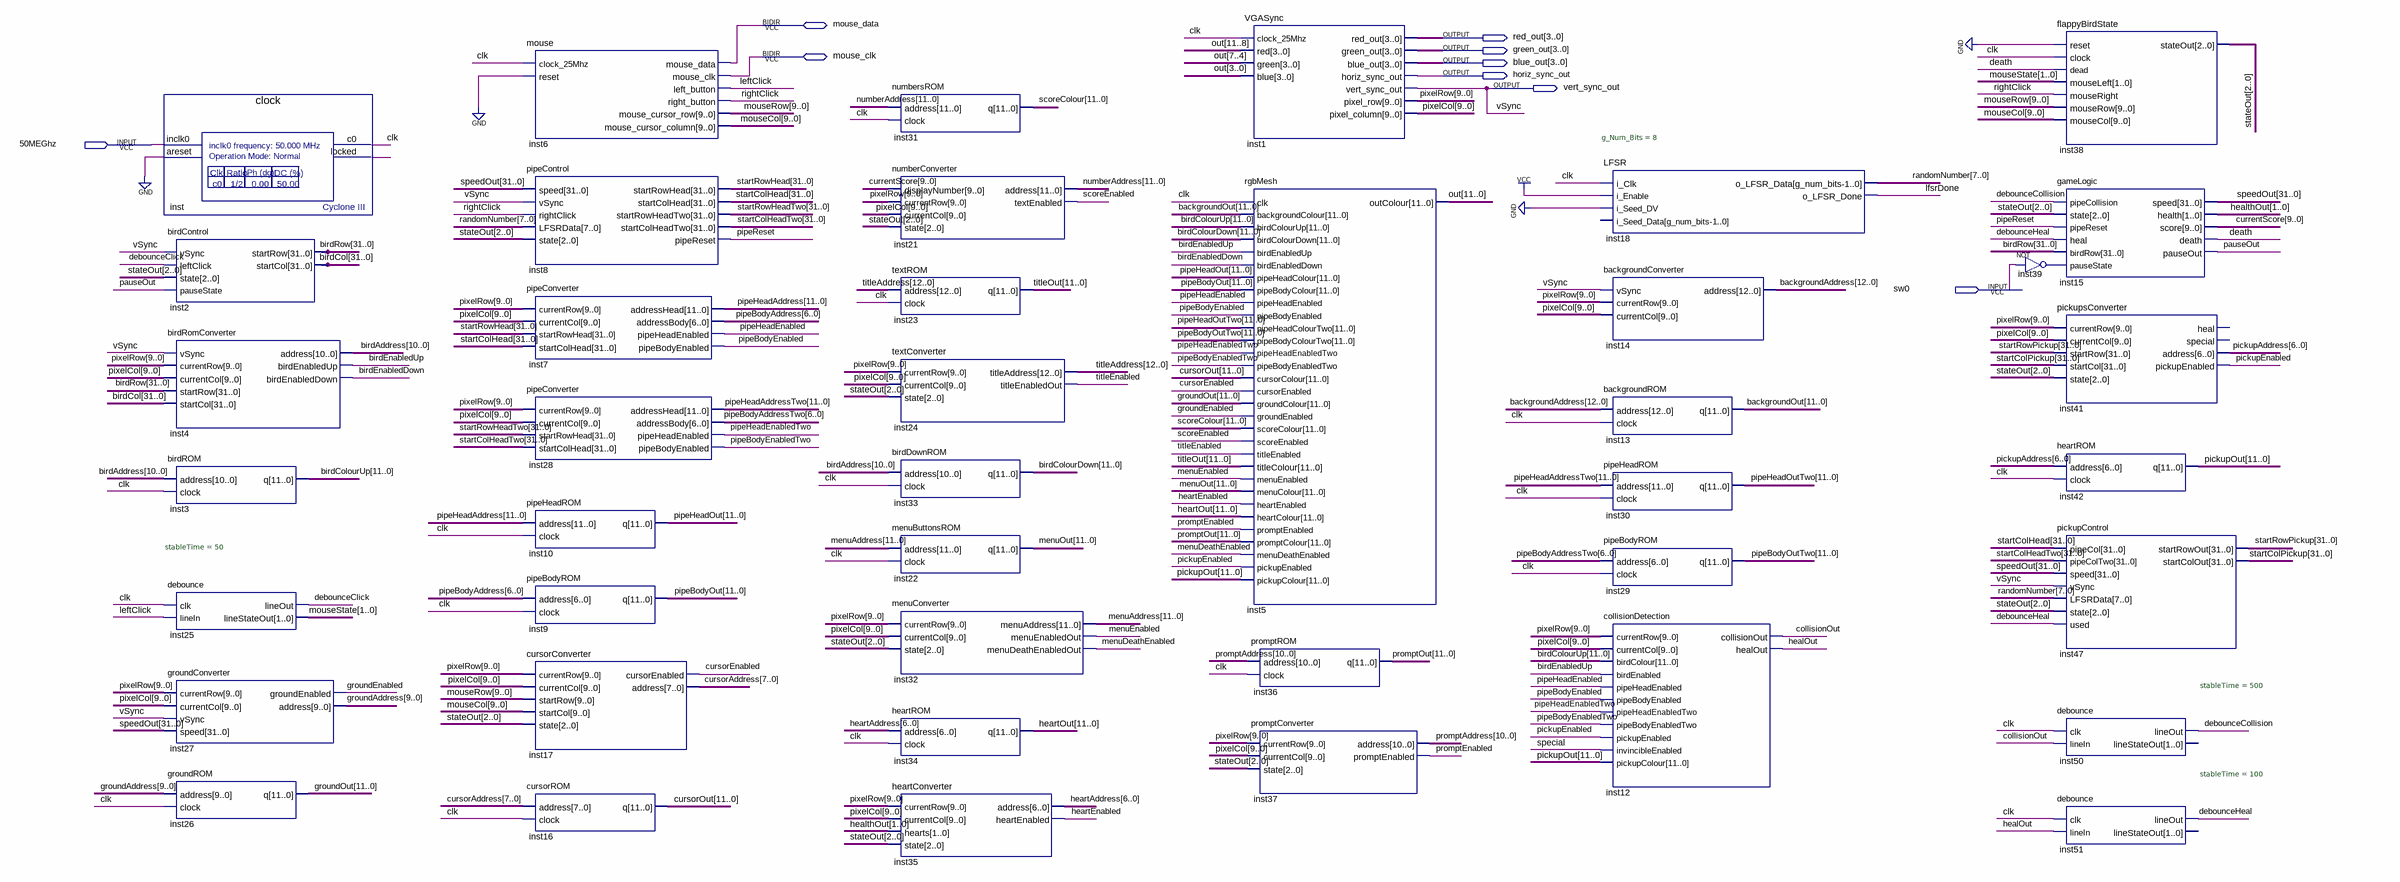
[diagram p0: schematic sheet]
// Quartus schematic FlappyBird.bdf as structural Verilog: 42 symbols, 9 pins
module FlappyBird (
  input  \50MEGhz ,
  input  sw0,
  inout  mouse_data,
  inout  mouse_clk,
  output [3:0] red_out,
  output [3:0] green_out,
  output [3:0] blue_out,
  output horiz_sync_out,
  output vert_sync_out
);

  wire birdEnabledDown, birdEnabledUp, clk, collisionOut, cursorEnabled, death, debounceClick,
       debounceCollision, debounceHeal, groundEnabled, healOut, heartEnabled, inst39_out, inst_locked,
       leftClick, lfsrDone, menuDeathEnabled, menuEnabled, pauseOut, pickupEnabled, pipeBodyEnabled,
       pipeBodyEnabledTwo, pipeHeadEnabled, pipeHeadEnabledTwo, pipeReset, promptEnabled, rightClick,
       scoreEnabled, special, titleEnabled;
  wire [1:0] healthOut, mouseState;
  wire [2:0] stateOut;
  wire [6:0] heartAddress, pickupAddress, pipeBodyAddress, pipeBodyAddressTwo;
  wire [7:0] cursorAddress, randomNumber;
  wire [9:0] currentScore, groundAddress, mouseCol, mouseRow, pixelCol, pixelRow;
  wire [10:0] birdAddress, promptAddress;
  wire [11:0] backgroundOut, birdColourDown, birdColourUp, cursorOut, groundOut, heartOut, menuAddress,
       menuOut, numberAddress, out, pickupOut, pipeBodyOut, pipeBodyOutTwo, pipeHeadAddress,
       pipeHeadAddressTwo, pipeHeadOut, pipeHeadOutTwo, promptOut, scoreColour, titleOut;
  wire [12:0] backgroundAddress, titleAddress;
  wire [31:0] birdCol, birdRow, speedOut, startColHead, startColHeadTwo, startColPickup, startRowHead,
       startRowHeadTwo, startRowPickup;

  clock inst (.inclk0(\50MEGhz ), .areset(1'b0), .c0(clk), .locked(inst_locked));
  birdControl inst2 (
    .vSync(vert_sync_out), .leftClick(debounceClick), .state(stateOut), .pauseState(pauseOut),
    .startRow(birdRow), .startCol(birdCol));
  birdRomConverter inst4 (
    .vSync(vert_sync_out), .currentRow(pixelRow), .currentCol(pixelCol), .startRow(birdRow),
    .startCol(birdCol), .address(birdAddress), .birdEnabledUp(birdEnabledUp),
    .birdEnabledDown(birdEnabledDown));
  birdROM inst3 (.address(birdAddress), .clock(clk), .q(birdColourUp));
  debounce #(.stableTime(50)) inst25 (
    .clk(clk), .lineIn(leftClick), .lineOut(debounceClick), .lineStateOut(mouseState));
  groundConverter inst27 (
    .currentRow(pixelRow), .currentCol(pixelCol), .vSync(vert_sync_out), .speed(speedOut),
    .groundEnabled(groundEnabled), .address(groundAddress));
  groundROM inst26 (.address(groundAddress), .clock(clk), .q(groundOut));
  mouse inst6 (
    .clock_25Mhz(clk), .reset(1'b0), .left_button(leftClick), .right_button(rightClick),
    .mouse_cursor_row(mouseRow), .mouse_cursor_column(mouseCol), .mouse_data(mouse_data),
    .mouse_clk(mouse_clk));
  pipeControl inst8 (
    .speed(speedOut), .vSync(vert_sync_out), .rightClick(rightClick), .LFSRData(randomNumber),
    .state(stateOut), .startRowHead(startRowHead), .startColHead(startColHead),
    .startRowHeadTwo(startRowHeadTwo), .startColHeadTwo(startColHeadTwo), .pipeReset(pipeReset));
  pipeConverter inst7 (
    .currentRow(pixelRow), .currentCol(pixelCol), .startRowHead(startRowHead), .startColHead(startColHead),
    .addressHead(pipeHeadAddress), .addressBody(pipeBodyAddress), .pipeHeadEnabled(pipeHeadEnabled),
    .pipeBodyEnabled(pipeBodyEnabled));
  pipeConverter inst28 (
    .currentRow(pixelRow), .currentCol(pixelCol), .startRowHead(startRowHeadTwo),
    .startColHead(startColHeadTwo), .addressHead(pipeHeadAddressTwo), .addressBody(pipeBodyAddressTwo),
    .pipeHeadEnabled(pipeHeadEnabledTwo), .pipeBodyEnabled(pipeBodyEnabledTwo));
  pipeHeadROM inst10 (.address(pipeHeadAddress), .clock(clk), .q(pipeHeadOut));
  pipeBodyROM inst9 (.address(pipeBodyAddress), .clock(clk), .q(pipeBodyOut));
  cursorConverter inst17 (
    .currentRow(pixelRow), .currentCol(pixelCol), .startRow(mouseRow), .startCol(mouseCol), .state(stateOut),
    .cursorEnabled(cursorEnabled), .address(cursorAddress));
  cursorROM inst16 (.address(cursorAddress), .clock(clk), .q(cursorOut));
  numbersROM inst31 (.address(numberAddress), .clock(clk), .q(scoreColour));
  numberConverter inst21 (
    .displayNumber(currentScore), .currentRow(pixelRow), .currentCol(pixelCol), .state(stateOut),
    .address(numberAddress), .textEnabled(scoreEnabled));
  textROM inst23 (.address(titleAddress), .clock(clk), .q(titleOut));
  textConverter inst24 (
    .currentRow(pixelRow), .currentCol(pixelCol), .state(stateOut), .titleAddress(titleAddress),
    .titleEnabledOut(titleEnabled));
  birdDownROM inst33 (.address(birdAddress), .clock(clk), .q(birdColourDown));
  menuButtonsROM inst22 (.address(menuAddress), .clock(clk), .q(menuOut));
  menuConverter inst32 (
    .currentRow(pixelRow), .currentCol(pixelCol), .state(stateOut), .menuAddress(menuAddress),
    .menuEnabledOut(menuEnabled), .menuDeathEnabledOut(menuDeathEnabled));
  heartROM inst34 (.address(heartAddress), .clock(clk), .q(heartOut));
  heartConverter inst35 (
    .currentRow(pixelRow), .currentCol(pixelCol), .hearts(healthOut), .state(stateOut),
    .address(heartAddress), .heartEnabled(heartEnabled));
  VGASync inst1 (
    .clock_25Mhz(clk), .red(out[11:8]), .green(out[7:4]), .blue(out[3:0]), .red_out(red_out),
    .green_out(green_out), .blue_out(blue_out), .horiz_sync_out(horiz_sync_out),
    .vert_sync_out(vert_sync_out), .pixel_row(pixelRow), .pixel_column(pixelCol));
  rgbMesh inst5 (
    .clk(clk), .backgroundColour(backgroundOut), .birdColourUp(birdColourUp),
    .birdColourDown(birdColourDown), .birdEnabledUp(birdEnabledUp), .birdEnabledDown(birdEnabledDown),
    .pipeHeadColour(pipeHeadOut), .pipeBodyColour(pipeBodyOut), .pipeHeadEnabled(pipeHeadEnabled),
    .pipeBodyEnabled(pipeBodyEnabled), .pipeHeadColourTwo(pipeHeadOutTwo),
    .pipeBodyColourTwo(pipeBodyOutTwo), .pipeHeadEnabledTwo(pipeHeadEnabledTwo),
    .pipeBodyEnabledTwo(pipeBodyEnabledTwo), .cursorColour(cursorOut), .cursorEnabled(cursorEnabled),
    .groundColour(groundOut), .groundEnabled(groundEnabled), .scoreColour(scoreColour),
    .scoreEnabled(scoreEnabled), .titleEnabled(titleEnabled), .titleColour(titleOut),
    .menuEnabled(menuEnabled), .menuColour(menuOut), .heartEnabled(heartEnabled), .heartColour(heartOut),
    .promptEnabled(promptEnabled), .promptColour(promptOut), .menuDeathEnabled(menuDeathEnabled),
    .pickupEnabled(pickupEnabled), .pickupColour(pickupOut), .outColour(out));
  promptROM inst36 (.address(promptAddress), .clock(clk), .q(promptOut));
  promptConverter inst37 (
    .currentRow(pixelRow), .currentCol(pixelCol), .state(stateOut), .address(promptAddress),
    .promptEnabled(promptEnabled));
  LFSR #(.g_Num_Bits(8)) inst18 (
    .i_Clk(clk), .i_Enable(1'b1), .i_Seed_DV(1'b0), .o_LFSR_Data(randomNumber), .o_LFSR_Done(lfsrDone));  // open: i_Seed_Data
  backgroundConverter inst14 (
    .vSync(vert_sync_out), .currentRow(pixelRow), .currentCol(pixelCol), .address(backgroundAddress));
  backgroundROM inst13 (.address(backgroundAddress), .clock(clk), .q(backgroundOut));
  pipeHeadROM inst30 (.address(pipeHeadAddressTwo), .clock(clk), .q(pipeHeadOutTwo));
  pipeBodyROM inst29 (.address(pipeBodyAddressTwo), .clock(clk), .q(pipeBodyOutTwo));
  collisionDetection inst12 (
    .currentRow(pixelRow), .currentCol(pixelCol), .birdColour(birdColourUp), .birdEnabled(birdEnabledUp),
    .pipeHeadEnabled(pipeHeadEnabled), .pipeBodyEnabled(pipeBodyEnabled),
    .pipeHeadEnabledTwo(pipeHeadEnabledTwo), .pipeBodyEnabledTwo(pipeBodyEnabledTwo),
    .pickupEnabled(pickupEnabled), .invincibleEnabled(special), .pickupColour(pickupOut),
    .collisionOut(collisionOut), .healOut(healOut));
  not inst39 (inst39_out, sw0);
  flappyBirdState inst38 (
    .reset(1'b0), .clock(clk), .dead(death), .mouseLeft(mouseState), .mouseRight(rightClick),
    .mouseRow(mouseRow), .mouseCol(mouseCol), .stateOut(stateOut));
  gameLogic inst15 (
    .pipeCollision(debounceCollision), .state(stateOut), .pipeReset(pipeReset), .heal(debounceHeal),
    .birdRow(birdRow), .pauseState(inst39_out), .speed(speedOut), .score(currentScore), .death(death),
    .pauseOut(pauseOut), .health(healthOut));
  pickupsConverter inst41 (
    .currentRow(pixelRow), .currentCol(pixelCol), .startRow(startRowPickup), .startCol(startColPickup),
    .state(stateOut), .address(pickupAddress), .pickupEnabled(pickupEnabled));  // open: heal, special
  heartROM inst42 (.address(pickupAddress), .clock(clk), .q(pickupOut));
  pickupControl inst47 (
    .pipeCol(startColHead), .pipeColTwo(startColHeadTwo), .speed(speedOut), .vSync(vert_sync_out),
    .LFSRData(randomNumber), .state(stateOut), .used(debounceHeal), .startRowOut(startRowPickup),
    .startColOut(startColPickup));
  debounce #(.stableTime(500)) inst50 (
    .clk(clk), .lineIn(collisionOut), .lineOut(debounceCollision));  // open: lineStateOut
  debounce #(.stableTime(100)) inst51 (.clk(clk), .lineIn(healOut), .lineOut(debounceHeal));  // open: lineStateOut

  // Other names for the same wires on the sheet: vSync = vert_sync_out
endmodule
